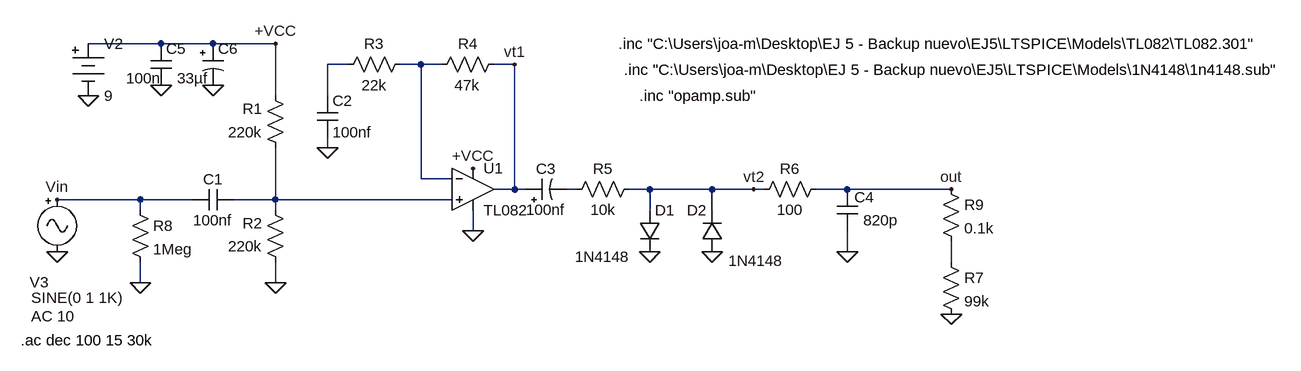
[diagram p0: schematic punto 5 senoide.asc]
punto 5 senoide.asc, the LTspice schematic file:
Version 4
SHEET 1 1528 680
WIRE -352 -80 -464 -80
WIRE -272 -80 -352 -80
WIRE -176 -80 -272 -80
WIRE -64 -48 -96 -48
WIRE 48 -48 16 -48
WIRE 80 -48 48 -48
WIRE 192 -48 160 -48
WIRE -176 0 -176 -80
WIRE -96 0 -96 -48
WIRE -96 80 -96 64
WIRE 48 128 48 -48
WIRE 96 128 48 128
WIRE 192 144 192 -48
WIRE 192 144 160 144
WIRE 208 144 192 144
WIRE 288 144 272 144
WIRE 400 144 368 144
WIRE 496 144 400 144
WIRE 560 144 496 144
WIRE 576 144 560 144
WIRE 704 144 656 144
WIRE 864 144 704 144
WIRE -384 160 -512 160
WIRE -304 160 -384 160
WIRE -176 160 -176 80
WIRE -176 160 -240 160
WIRE 96 160 -176 160
WIRE -384 176 -384 160
WIRE -176 176 -176 160
WIRE 400 176 400 144
WIRE 496 176 496 144
WIRE 128 208 128 176
WIRE 704 240 704 208
WIRE 864 256 864 224
WIRE -384 288 -384 256
WIRE -176 288 -176 256
FLAG -96 80 0
FLAG 704 240 0
FLAG 128 208 0
FLAG -176 288 0
FLAG -352 -16 0
FLAG -384 288 0
FLAG -512 240 0
FLAG -464 0 0
FLAG -512 160 Vin
FLAG -176 -80 +VCC
FLAG 128 112 +VCC
FLAG -272 -16 0
FLAG 192 -48 vt1
FLAG 560 144 vt2
FLAG 864 336 0
FLAG 864 144 out
FLAG 400 240 0
FLAG 496 240 0
SYMBOL res -160 96 R180
WINDOW 0 36 76 Left 2
WINDOW 3 36 40 Left 2
SYMATTR InstName R1
SYMATTR Value 220k
SYMBOL res -160 272 R180
WINDOW 0 36 76 Left 2
WINDOW 3 36 40 Left 2
SYMATTR InstName R2
SYMATTR Value 220k
SYMBOL res -80 -32 R270
WINDOW 0 32 56 VTop 2
WINDOW 3 0 56 VBottom 2
SYMATTR InstName R3
SYMATTR Value 22k
SYMBOL res 176 -64 R90
WINDOW 0 0 56 VBottom 2
WINDOW 3 32 57 VTop 2
SYMATTR InstName R4
SYMATTR Value 47k
SYMBOL res 384 128 R90
WINDOW 0 0 56 VBottom 2
WINDOW 3 32 56 VTop 2
SYMATTR InstName R5
SYMATTR Value 10k
SYMBOL cap -240 144 R90
WINDOW 0 0 32 VBottom 2
WINDOW 3 32 32 VTop 2
SYMATTR InstName C1
SYMATTR Value 100nf
SYMBOL cap 688 144 R0
WINDOW 0 27 12 Left 2
WINDOW 3 41 48 Left 2
SYMATTR InstName C4
SYMATTR Value 820p
SYMBOL res -400 160 R0
SYMATTR InstName R8
SYMATTR Value 1Meg
SYMBOL Misc\\battery -464 -96 R0
WINDOW 123 0 0 Left 2
WINDOW 39 0 0 Left 2
SYMATTR InstName V2
SYMATTR Value 9
SYMBOL Misc\\signal -512 144 R0
WINDOW 123 -40 195 Left 2
WINDOW 39 0 0 Left 2
WINDOW 0 -42 143 Left 2
WINDOW 3 -40 167 Left 2
SYMATTR Value2 AC 10
SYMATTR InstName V3
SYMBOL res 672 128 R90
WINDOW 0 0 56 VBottom 2
WINDOW 3 32 56 VTop 2
SYMATTR InstName R6
SYMATTR Value 100
SYMBOL polcap 208 160 R270
WINDOW 0 32 32 VTop 2
WINDOW 3 0 32 VBottom 2
SYMATTR InstName C3
SYMATTR Value 100nf
SYMBOL cap -368 -80 R0
WINDOW 3 -38 53 Left 2
SYMATTR Value 100n
SYMATTR InstName C5
SYMBOL polcap -288 -80 R0
WINDOW 3 -39 53 Left 2
SYMATTR Value 33µf
SYMATTR InstName C6
SYMBOL res 848 240 R0
SYMATTR InstName R7
SYMATTR Value 99k
SYMBOL res 848 128 R0
SYMATTR InstName R9
SYMATTR Value 0.1k
SYMBOL cap -112 0 R0
SYMATTR InstName C2
SYMATTR Value 100nf
SYMBOL Opamps\\opamp2 128 80 R0
SYMATTR InstName U1
SYMATTR Value TL082
SYMATTR SpiceModel TL082
SYMBOL diode 384 176 R0
WINDOW 3 -99 72 Left 2
SYMATTR InstName D1
SYMATTR Value 1N4148
SYMBOL diode 512 240 R180
WINDOW 0 24 64 Left 2
WINDOW 3 -94 -14 Left 2
SYMATTR InstName D2
SYMATTR Value 1N4148
TEXT 352 -80 Left 2 !.inc "C:\\Users\\joa-m\\Desktop\\EJ 5 - Backup nuevo\\EJ5\\LTSPICE\\Models\\TL082\\TL082.301"
TEXT 360 -40 Left 2 !.inc "C:\\Users\\joa-m\\Desktop\\EJ 5 - Backup nuevo\\EJ5\\LTSPICE\\Models\\1N4148\\1n4148.sub"
TEXT 384 0 Left 2 !.inc "opamp.sub"
TEXT -568 376 Left 2 !.ac dec 100 15 30k

The netlist it stands for:
* punto 5 senoide.asc
R1 N004 +VCC 220k
R2 0 N004 220k
R3 N001 N002 22k
R4 vt1 N002 47k
R5 vt2 N003 10k
C1 N004 Vin 100nf
C4 out 0 820p
R8 Vin 0 1Meg
V2 +VCC 0 9
V3 Vin 0 SINE(0 1 1K) AC 10
R6 out vt2 100
C3 vt1 N003 100nf
C5 +VCC 0 100n
C6 +VCC 0 33µf
R7 N005 0 99k
R9 out N005 0.1k
C2 N001 0 100nf
XU1 N004 N002 +VCC 0 vt1 TL082 TL082  ; pins In+ In- V+ V- OUT
D1 vt2 0 1N4148
D2 0 vt2 1N4148
.model D D
.lib standard.dio
.inc "C:\Users\joa-m\Desktop\EJ 5 - Backup nuevo\EJ5\LTSPICE\Models\TL082\TL082.301"
.inc "C:\Users\joa-m\Desktop\EJ 5 - Backup nuevo\EJ5\LTSPICE\Models\1N4148\1n4148.sub"
.inc "opamp.sub"
.ac dec 100 15 30k
.backanno
.end